# EAGLE schematic MVP_Schematic (EAGLE 7.5.0)
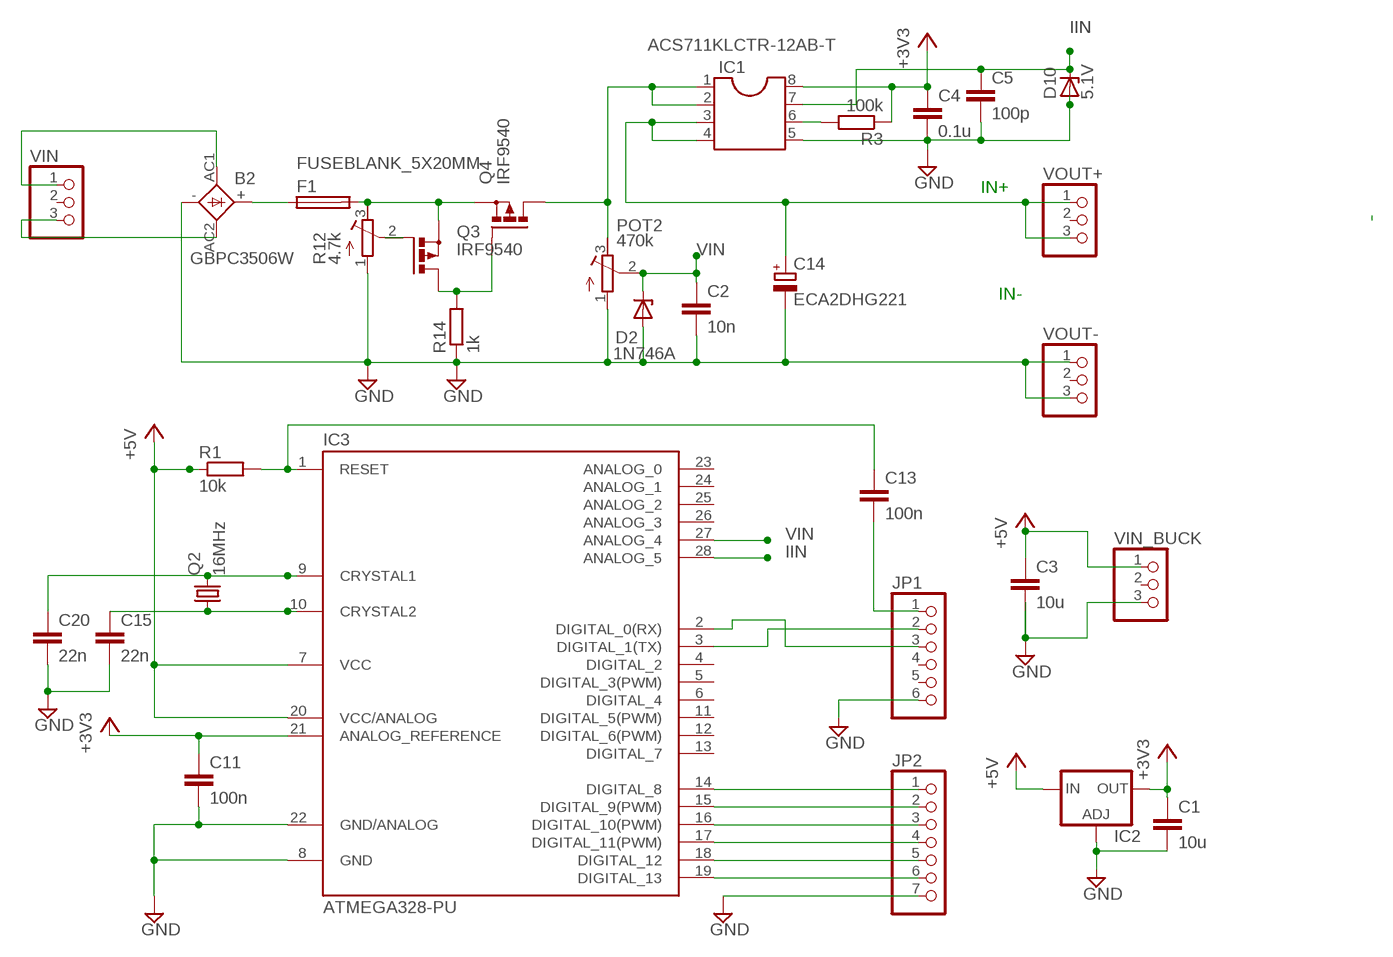
[diagram p0: schematic, sheet 1]

## Parts
B2  GBPC3506W  GBPC6  [GBPC6]
C1  10u  C-EUC1210  [C1210]
C2  10n  C-EUC1210  [C1210]
C3  10u  C-EUC1210  [C1210]
C4  0.1u  C-EUC1210  [C1210]
C5  100p  C-EUC1210  [C1210]
C11  100n  C-EUC1210  [C1210]
C13  100n  C-EUC1210  [C1210]
C14  ECA2DHG221  CPOL-EUE7.5-18  [E7,5-18]
C15  22n  C-EUC1210  [C1210]
C20  22n  C-EUC1210  [C1210]
D2  1N746A  ZENER-DIODEDO34-7  [DO34Z7]
D10  5.1V  ZPD  [DO35Z10]
F1  FUSEBLANK_5X20MM  [FUSE_HOLDER_5X20MM]
IC1  ACS711KLCTR-12AB-T  SOIC8  [SOIC8]
IC2  LM138-TS  [TO220S]
IC3  ATMEGA328-PU  ATMEGA168-PU  [DIL28-3]
JP1  PINHD-1X6  [1X06]
JP2  PINHD-1X7  [1X07]
POT2  470k  R-TRIMM4G/J  [RTRIM4G/J]
Q2  16MHz  CRYSTALHC49S  [HC49/S]
Q3  IRF9540  PMOSFET_PTO220BV  [TO220BV]
Q4  IRF9540  PMOSFET_PTO220BV  [TO220BV]
R1  10k  R-EU_R1210  [R1210]
R3  100k  R-EU_R1210  [R1210]
R12  4.7k  R-TRIMM4G/J  [RTRIM4G/J]
R14  1k  R-EU_R1210  [R1210]
VIN  PINHD-1X3  [1X03]
VIN_BUCK  PINHD-1X3  [1X03]
VOUT+  PINHD-1X3  [1X03]
VOUT-  PINHD-1X3  [1X03]

## Nets
+3V3: C1.1 C4.1 C11.1 IC1.8 IC2.2(OUT) IC3.21(ANALOG_REFERENCE) R3.1
+5V: C3.1 IC2.3(IN) IC3.7(VCC) IC3.20(VCC/ANALOG) R1.1 VIN_BUCK.1
GND: B2.- C1.2 C2.2 C3.2 C4.2 C5.2 C11.2 C14.- C15.2 C20.2 D2.A D10.A IC1.5 IC2.1(ADJ) IC3.8(GND) IC3.22(GND/ANALOG) JP2.7 POT2.1(A) R12.1(A) R14.1 VIN_BUCK.3 VOUT-.1 VOUT-.3
IIN: C5.1 D10.C IC1.7 IC3.28(ANALOG_5)
M1S: C14.+ IC1.3 IC1.4 VOUT+.1 VOUT+.3
N$1: B2.+ F1.1
N$2: IC1.6 R3.2
N$3: IC1.1 IC1.2 POT2.3(E) Q4.D
N$4: IC3.3(DIGITAL_1(TX)) JP1.2
N$5: IC3.2(DIGITAL_0(RX)) JP1.3
N$6: IC3.15(DIGITAL_9(PWM)) JP2.2
N$8: IC3.19(DIGITAL_13) JP2.6
N$9: IC3.14(DIGITAL_8) JP2.1
N$10: F1.2 Q3.S Q4.S R12.3(E)
N$11: IC3.16(DIGITAL_10(PWM)) JP2.3
N$12: IC3.17(DIGITAL_11(PWM)) JP2.4
N$13: IC3.18(DIGITAL_12) JP2.5
N$14: C13.2 JP1.1
N$15: C15.1 IC3.10(CRYSTAL2) Q2.1
N$16: C20.1 IC3.9(CRYSTAL1) Q2.2
N$17: C13.1 IC3.1(RESET) R1.2
N$19: B2.AC2 VIN.3
N$20: B2.AC1 VIN.1
N$21: JP1.6
N$35: Q3.D Q4.G R14.2
N$36: Q3.G R12.2(S)
VIN: C2.1 D2.C IC3.27(ANALOG_4) POT2.2(S)
Unconnected: IC3.4(DIGITAL_2) IC3.5(DIGITAL_3(PWM)) IC3.6(DIGITAL_4) IC3.11(DIGITAL_5(PWM)) IC3.12(DIGITAL_6(PWM)) IC3.13(DIGITAL_7) IC3.23(ANALOG_0) IC3.24(ANALOG_1) IC3.25(ANALOG_2) IC3.26(ANALOG_3) JP1.4 JP1.5 VIN.2 VIN_BUCK.2 VOUT+.2 VOUT-.2

## Notes on the sheet
- IN+
- IN-

## Library data of the parts
B2 = rectifier:GBPC6: GENERAL INSTRUMENT RECTIFIER
C1-C5 C11 C13 C15 C20 = resistor:C-EU: CAPACITOR, European symbol
C14 = rcl:CPOL-EU: POLARIZED CAPACITOR, European symbol
D2 = diode:ZENER-DIODE: Z-Diode
D10 = diode:ZPD: Z DIODE 500 mW
F1 = fuse:FUSE: Fuse; OC_FARNELL: unknown; OC_NEWARK: unknown
IC1 = mylibrary:SOIC8: Dual In Line / Socket
IC2 = v-reg:LM138-TS: VOLTAGE REGULATOR
IC3 = Arduino-AVR:ATMEGA168-PU
JP1 = pinhead:PINHD-1X6: PIN HEADER
JP2 = pinhead:PINHD-1X7: PIN HEADER
POT2 R12 = resistor:R-TRIMM: Trimm resistor
Q2 = crystal:CRYSTAL: CRYSTAL; OC_FARNELL: 1667008; OC_NEWARK: unknown
Q3 Q4 = transistor-power:PMOSFET_P: Power MOSFET P-Channel
R1 R3 R14 = resistor:R-EU_: RESISTOR, European symbol
VIN VIN_BUCK VOUT+ VOUT- = pinhead:PINHD-1X3: PIN HEADER

## Module BB1
Ports: 

### Library data of the parts